# EAGLE design PowerSupply (EAGLE 9.6.2)
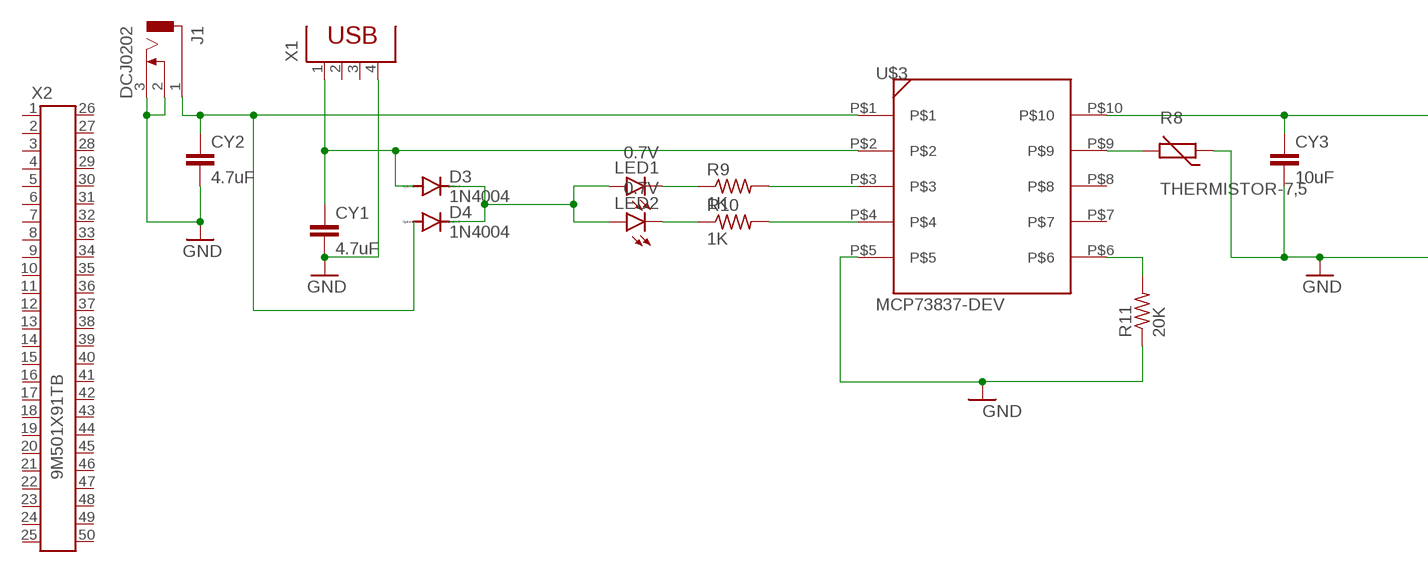
[diagram p0: schematic, sheet 1, part 1 of 2]
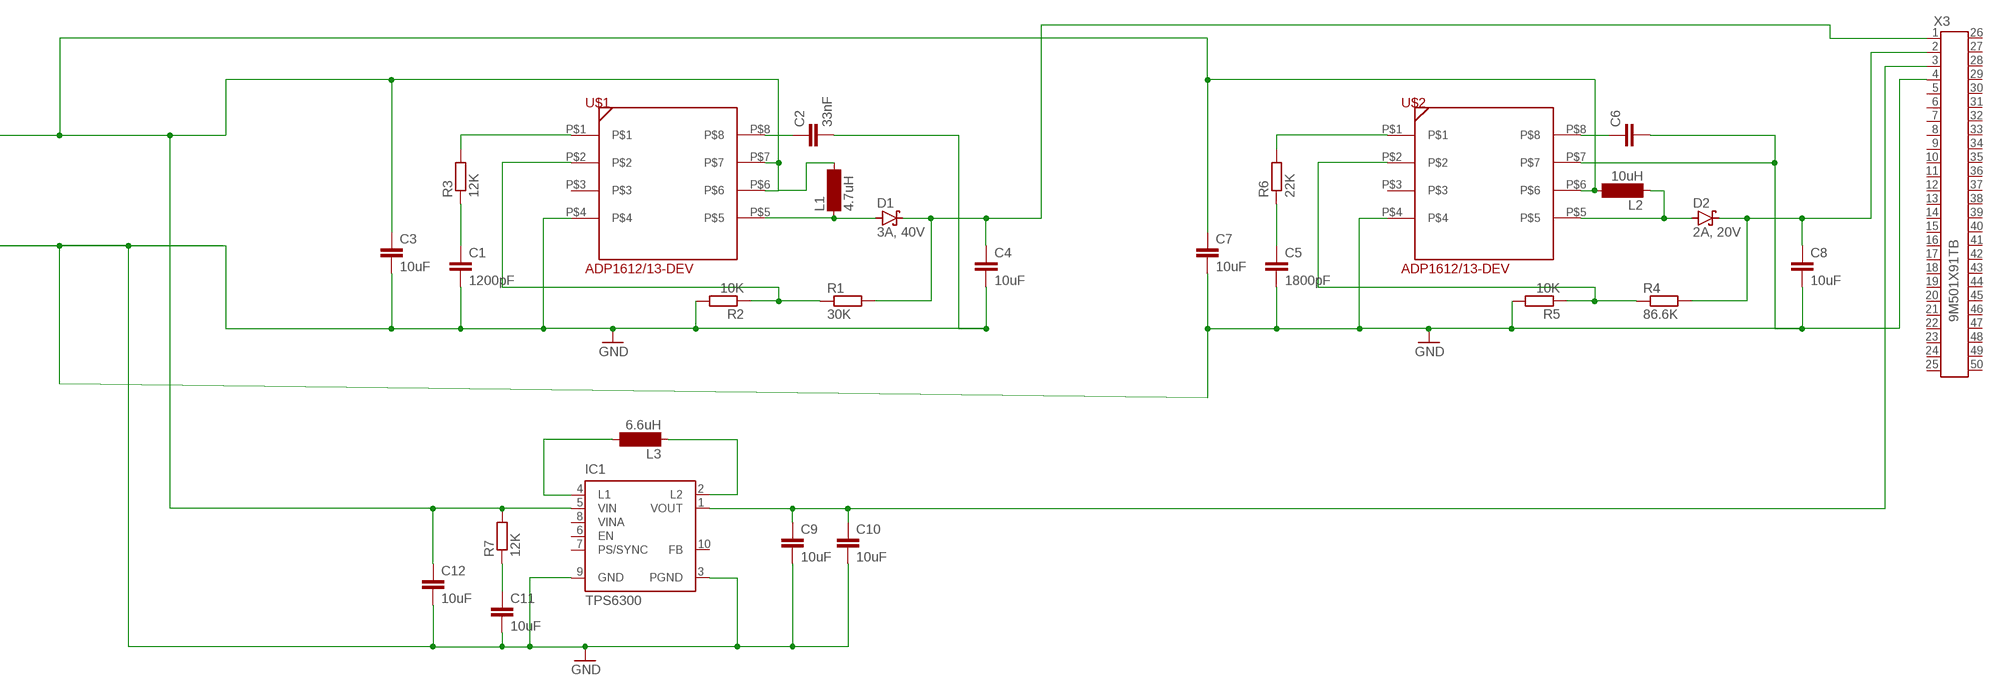
[diagram p1: schematic, sheet 1, part 2 of 2]

## Parts
C1  1200pF  C2.5/2  [C2.5-2]
C2  33nF  C2.5/2  [C2.5-2]
C3  10uF  C2.5/2  [C2.5-2]
C4  10uF  C2.5/2  [C2.5-2]
C5  1800pF  C2.5/2  [C2.5-2]
C6  C2.5/2  [C2.5-2]
C7  10uF  C2.5/2  [C2.5-2]
C8  10uF  C2.5/2  [C2.5-2]
C9  10uF  C2,5-3  [C2.5-3]
C10  10uF  C2,5-3  [C2.5-3]
C11  10uF  C2,5-3  [C2.5-3]
C12  10uF  C2,5-3  [C2.5-3]
CY1  4.7uF  CYYC10B4  [YC10B4]
CY2  4.7uF  CYYC10B4  [YC10B4]
CY3  10uF  CYYC10B4  [YC10B4]
D1  3A, 40V  1N5638  [DO13M]
D2  2A, 20V  1N5638  [DO13M]
D3  1N4004  [DO41-10]
D4  1N4004  [DO41-10]
IC1  TPS6300  [DRC-S-PVSON-N10]
J1  DCJ0202  [DCJ0202]
L1  4.7uH  SM-NE45  [SM-NE45]
L2  10uH  SM-NE45  [SM-NE45]
L3  6.6uH  SM-NE45  [SM-NE45]
LED1  0.7V  LED  [SMARTLED-TTW]
LED2  0.7V  LED  [SMARTLED-TTW]
R1  30K  R-EU_0204/2V  [0204V]
R2  10K  R-EU_0204/2V  [0204V]
R3  12K  R-EU_0204/2V  [0204V]
R4  86.6K  R-EU_0204/2V  [0204V]
R5  10K  R-EU_0204/2V  [0204V]
R6  22K  R-EU_0204/2V  [0204V]
R7  12K  R-EU_0204/2V  [0204V]
R8  THERMISTOR-7,5  [R-7,5]
R9  1K  R-US_0204/2V  [0204V]
R10  1K  R-US_0204/2V  [0204V]
R11  20K  R-US_0204/2V  [0204V]
U$1  ADP1612/13-DEV  [ADP1612/13]
U$2  ADP1612/13-DEV  [ADP1612/13]
U$3  MCP73837-DEV  [MCP73837-FCI]
X1  PN61729  [PN61729]
X2  9M501X91TB  [9M501X91]
X3  9M501X91TB  [9M501X91]

## Nets
GND: C1.2 C2.2 C3.2 C4.2 C5.2 C6.2 C7.2 C8.2 C9.2 C10.2 C11.2 C12.2 CY1.2 CY2.2 CY3.2 IC1.3(PGND) IC1.9(GND) J1.2 J1.3 R2.2 R5.2 R8.1 R11.1 U$1.P$4 U$2.P$4 U$2.P$7 U$3.P$5 X1.4 X3.4
N$1: C2.1 U$1.P$8
N$3: R3.2 U$1.P$1
N$4: C1.1 R3.1
N$5: D1.A L1.1 U$1.P$5
N$6: C4.1 D1.C R1.2 X3.1
N$9: R1.1 R2.1 U$1.P$2
N$10: R6.2 U$2.P$1
N$11: C5.1 R6.1
N$12: C8.1 D2.C R4.2 X3.2
N$13: C6.1 U$2.P$8
N$14: D2.A L2.1 U$2.P$5
N$16: R4.1 R5.1 U$2.P$2
N$18: C11.1 R7.1
N$19: C3.1 C7.1 C12.1 CY3.1 IC1.5(VIN) L1.2 L2.2 R7.2 U$1.P$6 U$1.P$7 U$2.P$6 U$3.P$10
N$20: IC1.4(L1) L3.2
N$21: IC1.2(L2) L3.1
N$22: C9.1 C10.1 IC1.1(VOUT) X3.3
N$23: LED1.C@1(C) R9.1
N$24: LED2.C@1(C) R10.1
N$25: R10.2 U$3.P$4
N$26: R9.2 U$3.P$3
N$27: R11.2 U$3.P$6
N$29: R8.2 U$3.P$9
N$30: CY1.1 D3.A U$3.P$2 X1.1
N$31: D3.C D4.C LED1.A@1(A) LED2.A@1(A)
N$32: CY2.1 D4.A J1.1 U$3.P$1
Unconnected: IC1.6(EN) IC1.7(PS/SYNC) IC1.8(VINA) IC1.10(FB) IC1.TH U$1.P$3 U$2.P$3 U$3.P$7 U$3.P$8 X1.2 X1.3 X2.1 X2.2 X2.3 X2.4 X2.5 X2.6 X2.7 X2.8 X2.9 X2.10 X2.11 X2.12 X2.13 X2.14 X2.15 X2.16 X2.17 X2.18 X2.19 X2.20 X2.21 X2.22 X2.23 X2.24 X2.25 X2.26 X2.27 X2.28 X2.29 X2.30 X2.31 X2.32 X2.33 X2.34 X2.35 X2.36 X2.37 X2.38 X2.39 X2.40 X2.41 X2.42 X2.43 X2.44 X2.45 X2.46 X2.47 X2.48 X2.49 X2.50 X3.5 X3.6 X3.7 X3.8 X3.9 X3.10 X3.11 X3.12 X3.13 X3.14 X3.15 X3.16 X3.17 X3.18 X3.19 X3.20 X3.21 X3.22 X3.23 X3.24 X3.25 X3.26 X3.27 X3.28 X3.29 X3.30 X3.31 X3.32 X3.33 X3.34 X3.35 X3.36 X3.37 X3.38 X3.39 X3.40 X3.41 X3.42 X3.43 X3.44 X3.45 X3.46 X3.47 X3.48 X3.49 X3.50

## Library data of the parts
C1-C12 = capacitor-wima:C: CAPACITOR naming: grid - package width
CY1-CY3 = rcl:CY: Y CAPACITOR for power line; SPICEPREFIX: C
D1 D2 = diode:1N5638: DIODE schottky
D3 D4 = diode:1N4004: DIODE general purpose rectifier, 1 A
IC1 = texas:TPS6300*: HIGH EFFICIENT SINGLE INDUCTOR BUCK-BOOST CONVERTER WITH 1.8-A SWITCHES Source: http://focus.ti.com/lit/ds/symlink/tps63001.pdf; MPN: TPS63000DRCTG4; OC_FARNELL: 1511852; OC_NEWARK: 59M7217
J1 = con-jack:DCJ0202: DC POWER JACK Source: DCJ0202.pdf; OC_FARNELL: unknown; OC_NEWARK: unknown
L1-L3 = inductor-neosid:SM-NE45: INDUCTOR SMD chip inductor; OC_FARNELL: unknown; OC_NEWARK: unknown
LED1 LED2 = led:LED: LED OSRAM: - CHIPLED LG R971, LG N971, LY N971, LG Q971, LY Q971, LO R971, LY R971 LH N974, LH R974 LS Q976, LO Q976, LY Q976 LO Q996 - Hyper CHIPLED LW Q18S LB Q993, LB Q99A, LB R99A - SideLED LS A670, LO A670, LY A670, LG A670, LP A670 LB A673, LV A673, LT A673, LW A673 LH A674 LY A675 LS A676, LA A676, LO A676, LY A676, LW A676 LS A679, LY A679, LG A679 - Hyper Micro SIDELED® LS Y876, LA Y876, LO Y876, LY Y876 LT Y87S - SmartLED LW L88C, LW L88S LB L89C, LB L89S, LG L890 LS L89K, LO L89K, LY L89K LS L896, LA L896, LO L896, LY L896 - TOPLED LS T670, LO T670, LY T670, LG T670, LP T670 LSG T670, LSP T670, LSY T670, LOP T670, LYG T670 LG T671, LOG T671, LSG T671 LB T673, LV T673, LT T673, LW T673 LH T674 LS T676, LA T676, LO T676, LY T676, LB T676, LH T676, LSB T676, LW T676 LB T67C, LV T67C, LT T67C, LS T67K, LO T67K, LY T67K, LW E67C LS E67B, LA E67B, LO E67B, LY E67B, LB E67C, LV E67C, LT E67C LW T67C LS T679, LY T679, LG T679 LS T770, LO T770, LY T770, LG T770, LP T770 LB T773, LV T773, LT T773, LW T773 LH T774 LS E675, LA E675, LY E675, LS T675 LS T776, LA T776, LO T776, LY T776, LB T776 LHGB T686 LT T68C, LB T68C - Hyper Mini TOPLED® LB M676 - Mini TOPLED Santana® LG M470 LS M47K, LO M47K, LY M47K Source: http://www.osram.convergy.de LUXEON: - LUMILED® LXK2-PW12-R00, LXK2-PW12-S00, LXK2-PW14-U00, LXK2-PW14-V00 LXK2-PM12-R00, LXK2-PM12-S00, LXK2-PM14-U00 LXK2-PE12-Q00, LXK2-PE12-R00, LXK2-PE12-S00, LXK2-PE14-T00, LXK2-PE14-U00 LXK2-PB12-K00, LXK2-PB12-L00, LXK2-PB12-M00, LXK2-PB14-N00, LXK2-PB14-P00, LXK2-PB14-Q00 LXK2-PR12-L00, LXK2-PR12-M00, LXK2-PR14-Q00, LXK2-PR14-R00 LXK2-PD12-Q00, LXK2-PD12-R00, LXK2-PD12-S00 LXK2-PH12-R00, LXK2-PH12-S00 LXK2-PL12-P00, LXK2-PL12-Q00, LXK2-PL12-R00 Source: www.luxeon.com KINGBRIGHT: KA-3528ASYC Source: www.kingbright.com
R1-R7 = rcl:R-EU_: RESISTOR, European symbol; SPICEPREFIX: R
R8 = varistor:THERMISTOR: THERMISTOR
R9-R11 = rcl:R-US_: RESISTOR, American symbol; SPICEPREFIX: R
U$1 U$2 = ADP:ADP1612/13-DEV
U$3 = charger:MCP73837-DEV
X1 = con-berg:PN61729: BERG USB connector; OC_FARNELL: unknown; OC_NEWARK: unknown
X2 X3 = con-3m:9M501X91TB: CONNECTOR PCMCIA-CompactFlash; OC_FARNELL: unknown; OC_NEWARK: unknown

## Board
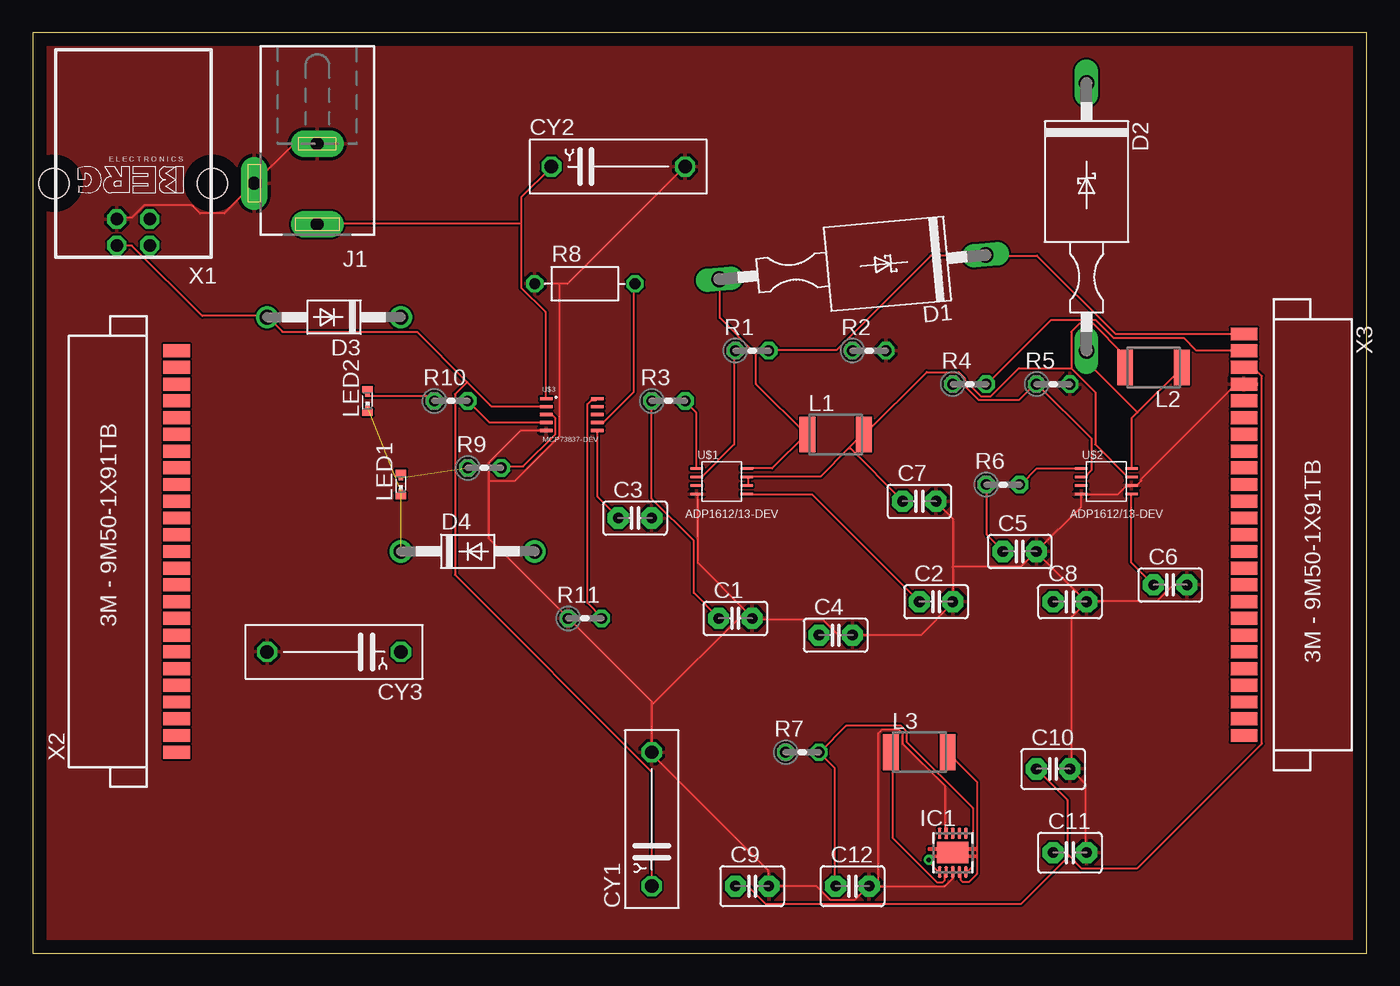
[diagram p2: board, top side]
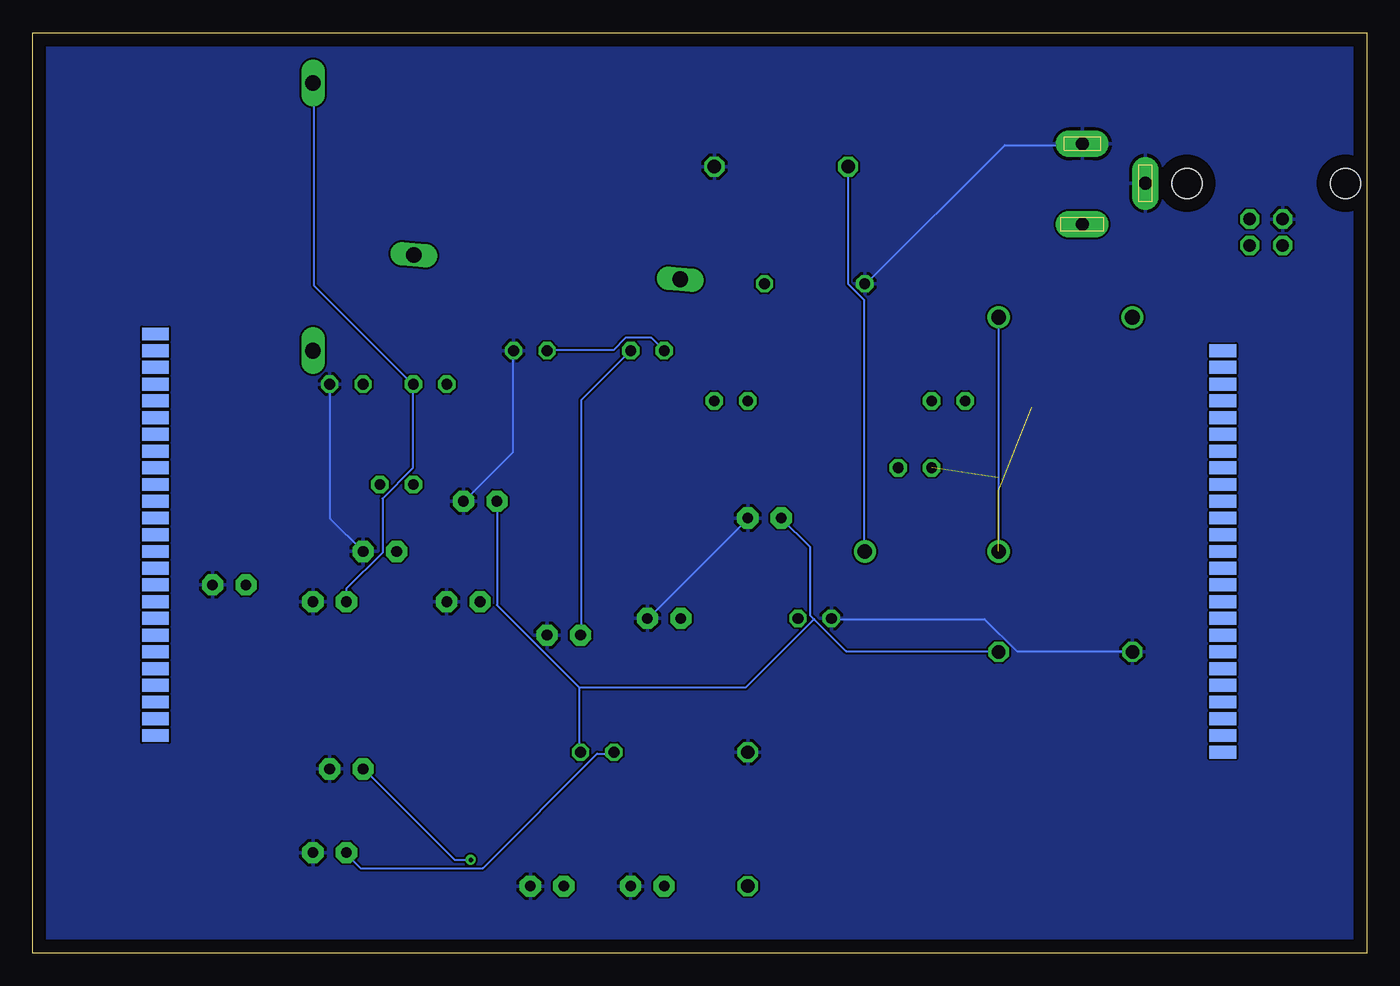
[diagram p3: board, bottom side, seen from below]

Size 101.27 x 69.84 mm. Coordinates in mm from the lower left corner, seen from the top.
Outline: 0,0 101.27,0 101.27,69.84 0,69.84 0,0
Copper layers (1*16): Top 0.035mm / dielectric 1.5mm / Bottom 0.035mm
Design rules "default": minimum track width 6mil, minimum drill 0.35mm, track to track 6mil, track to pad 6mil, pad to pad 6mil, via to via 6mil, smd to smd 6mil, copper to edge 40mil, drill to drill 6mil, minimum pad ring 10mil, minimum via ring 8mil, stop-mask expansion 4mil, vias tented up to drill 0mil, thermal gap 10mil

### Footprints (pad centres in the part's own frame; a part is rotated, then mirrored left to right if it is on the bottom)
C2.5-2 = drill 0.813 pad 1.6 octagon: 1 -1.27,0; 2 1.27,0
C2.5-3 = drill 0.813 pad 1.6 octagon: 1 -1.27,0; 2 1.27,0
YC10B4 = drill 1.016 octagon: 1 -5.08,0; 2 5.08,0
DO13M = drill 1.194 long: A 10.16,0; C -10.16,0
DO41-10 = drill 1.118: A 5.08,0; C -5.08,0
DRC-S-PVSON-N10 = smd 0.28 x 0.85: 1 -1,-1.475; 2 -0.5,-1.475; 3 0,-1.475; 4 0.5,-1.475; 5 1,-1.475; 6 1,1.475; 7 0.5,1.475; 8 0,1.475; 9 -0.5,1.475; 10 -1,1.475 | smd 2.4 x 1.65: TH 0,0
DCJ0202 = drill 1 pad 2 long: 1 0,3.1; 2 4.8,0; 3 0,-3
SM-NE45 = smd 1.2 x 2.7: 1 -2.15,0; 2 2.15,0
SMARTLED-TTW = smd 0.8 x 0.5: A 0,-0.875; C 0,0.875 | smd 0.35 x 0.35: A@1 0,-0.5; C@1 0,0.5
0204V = drill 0.813 octagon: 1 -1.27,0; 2 1.27,0
R-7,5 = drill 0.813 octagon: 1 -3.81,0; 2 3.81,0
ADP1612/13 = smd 0.95 x 0.2: P$1 -0.4,2.5; P$2 -0.4,1.85; P$3 -0.4,1.2; P$4 -0.4,0.55; P$5 3.4,2.5; P$6 3.4,1.85; P$7 3.4,1.2; P$8 3.4,0.55
MCP73837-FCI = smd 0.95 x 0.25: P$1 -0.4,2.7; P$2 -0.4,2.1; P$3 -0.4,1.5; P$4 -0.4,0.9; P$5 -0.4,0.3; P$6 3.5,2.7; P$7 3.5,2.1; P$8 3.5,1.5; P$9 3.5,0.9; P$10 3.5,0.3
PN61729 = drill 0.95 octagon: 1 1.25,4.71; 2 -1.25,4.71; 3 -1.25,2.71; 4 1.25,2.71 | hole 2.3: -6.02,0; 6.02,0
9M501X91 = smd 0.98 x 2.03: 1 -15.24,-3.29; 2 -13.97,-3.29; 3 -12.7,-3.29; 4 -11.43,-3.29; 5 -10.16,-3.29; 6 -8.89,-3.29; 7 -7.62,-3.29; 8 -6.35,-3.29; 9 -5.08,-3.29; 10 -3.81,-3.29; 11 -2.54,-3.29; 12 -1.27,-3.29; 13 0,-3.29; 14 1.27,-3.29; 15 2.54,-3.29; 16 3.81,-3.29; 17 5.08,-3.29; 18 6.35,-3.29; 19 7.62,-3.29; 20 8.89,-3.29; 21 10.16,-3.29; 22 11.43,-3.29; 23 12.7,-3.29; 24 13.97,-3.29; 25 15.24,-3.29 | smd 0.98 x 2.03 bottom: 26 -15.24,-3.29; 27 -13.97,-3.29; 28 -12.7,-3.29; 29 -11.43,-3.29; 30 -10.16,-3.29; 31 -8.89,-3.29; 32 -7.62,-3.29; 33 -6.35,-3.29; 34 -5.08,-3.29; 35 -3.81,-3.29; 36 -2.54,-3.29; 37 -1.27,-3.29; 38 0,-3.29; 39 1.27,-3.29; 40 2.54,-3.29; 41 3.81,-3.29; 42 5.08,-3.29; 43 6.35,-3.29; 44 7.62,-3.29; 45 8.89,-3.29; 46 10.16,-3.29; 47 11.43,-3.29; 48 12.7,-3.29; 49 13.97,-3.29; 50 15.24,-3.29

### Placement (x,y rotation side)
C1  53.34,25.4 0 top
C2  68.58,26.67 0 top
C3  45.72,33.02 0 top
C4  60.96,24.13 0 top
C5  74.93,30.48 0 top
C6  86.36,27.94 0 top
C7  67.31,34.29 0 top
C8  78.74,26.67 0 top
C9  54.61,5.08 0 top
C10  77.47,13.97 0 top
C11  78.74,7.62 0 top
C12  62.23,5.08 0 top
CY1  46.99,10.16 90 top
CY2  44.45,59.69 0 top
CY3  22.86,22.86 180 top
D1  62.23,52.07 185.2 top
D2  80.01,55.88 270 top
D3  22.86,48.26 180 top
D4  33.02,30.48 0 top
IC1  69.85,7.62 0 top
J1  21.59,58.42 180 top
L1  60.96,39.37 0 top
L2  85.09,44.45 180 top
L3  67.31,15.24 0 top
LED1  27.94,35.56 0 top
LED2  25.4,41.91 0 top
R1  54.61,45.72 0 top
R2  63.5,45.72 0 top
R3  48.26,41.91 0 top
R4  71.12,43.18 0 top
R5  77.47,43.18 0 top
R6  73.66,35.56 0 top
R7  58.42,15.24 0 top
R8  41.91,50.8 0 top
R9  34.29,36.83 0 top
R10  31.75,41.91 0 top
R11  41.91,25.4 0 top
U$1  50.8,34.29 0 top
U$2  80.01,34.29 0 top
U$3  39.37,39.37 0 top
X1  7.62,58.42 180 top
X2  7.62,30.48 90 top
X3  95.25,31.75 270 top

### Tracks (layer width: path | path; a pad name or v marks a point on that pad's centre or on a via)
GND
  Top 0.152: 54.15,25.96 54.61,25.5 C1.2 | 54.15,25.96 50.5,29.62 50.5,34.8 U$1.P$4 | C1.2 54.61,25.35 59.94,25.35 61.16,24.13 C4.2 67.41,24.13 69.85,26.57 C2.2 69.85,29.31 | 69.85,29.31 69.85,32.97 68.63,34.19 C7.2 | X3.4 91.34,43.18 84.18,36.02 84.18,35.86 83.87,35.56 83.41,35.56 U$2.P$7 83.26,35.41 82.96,35.41 82.35,34.8 79.76,34.8 U$2.P$4 79.6,34.8 79.6,33.88 C5.2 | C11.2 79.91,7.67 79.91,12.85 78.84,13.92 C10.2 78.84,14.07 78.84,25.5 C8.2 | C8.2 79.91,26.72 76.25,30.38 C5.2 | C6.2 86.61,27.94 85.39,26.72 80.06,26.72 C8.2 | 69.85,29.31 75.03,29.31 C5.2 | IC1.3 69.85,5.69 69.24,5.08 64.21,5.08 | C12.2 64.21,5.08 | 64.21,5.08 64.21,16.66 64.52,16.97 65.73,16.97 66.04,16.66 66.04,15.9 69.24,12.7 69.24,9.2 IC1.9 | 63.6,5.08 C12.2 | C12.2 63.45,5.08 62.38,4.01 60.55,4.01 59.49,5.08 C9.2 55.83,5.08 55.83,6.3 46.99,15.14 CY1.2 46.99,18.8 | 16.82,58.42 14.53,56.13 12.7,56.13 12.09,56.74 8.43,56.74 7.52,55.83 6.45,55.83 X1.4 | 16.82,58.42 19.71,61.32 21.54,61.32 J1.3 | 16.82,58.42 J1.2 | 39.98,50.8 40.59,50.8 49.43,59.64 CY2.2 | 39.98,50.8 R8.1 | 34.65,35.86 34.65,31.44 40.59,25.5 R11.1 40.74,25.35 46.99,19.1 46.99,18.8 | 34.65,35.86 34.65,37.24 37.08,39.67 38.91,39.67 U$3.P$5 | 39.98,50.8 39.98,39.22 36.63,35.86 34.65,35.86 | 46.99,18.8 54.15,25.96 | 54.15,25.96 C1.2
  Bottom 0.152: C3.2 46.99,32.97 54.61,25.35 C1.2 | R2.2 64.82,45.62 64.82,38 68.48,34.34 C7.2 | C5.2 78.69,32.97 78.69,43.18 R5.2 | CY3.2 17.88,22.91 26.57,22.91 29.01,25.35 40.59,25.35 R11.1 | J1.3 21.69,61.32 27.48,61.32 38,50.8 R8.1
  pour Top: -3.81,72.39 101.6,72.39 104.14,69.85 104.14,1.27 99.06,-3.81 1.27,-3.81 -3.81,1.27
  pour Bottom: -5.08,73.66 106.68,73.66 106.68,-5.08 105.41,-5.08 -6.35,-5.08
N$1
  Top 0.152: C2.1 59.18,34.8 54.3,34.8 U$1.P$8
N$3
  Top 0.152: U$1.P$1 50.34,36.78 50.34,41.05 49.58,41.81 R3.2
N$4
  Top 0.152: R3.1 46.99,34.49 50.19,31.29 50.19,27.33 52.02,25.5 C1.1
N$5
  Top 0.152: 58.73,39.37 56.13,36.78 54.3,36.78 U$1.P$5 | 58.73,39.37 54.92,43.18 54.92,45.47 52.17,48.21 52.17,51.11 D1.A | 58.73,39.37 L1.1
N$6
  Top 0.152: X3.1 82.19,46.99 76.25,52.93 72.44,52.93 D1.C 72.29,52.93 68.17,52.93 61.01,45.77 55.98,45.77 R1.2
  Bottom 0.152: R1.2 59.64,41.96 59.64,24.13 C4.1
N$9
  Top 0.152: U$1.P$2 50.5,36.17 50.8,36.17 53.24,38.61 53.24,45.62 R1.1
  Bottom 0.152: R1.1 54.3,46.69 56.29,46.69 57.2,45.77 62.23,45.77 R2.1
N$10
  Top 0.152: U$2.P$1 76.25,36.78 75.03,35.56 R6.2
N$11
  Top 0.152: R6.1 72.44,35.56 72.44,31.75 73.66,30.53 C5.1
N$12
  Top 0.152: X3.2 91.95,45.77 88.29,45.77 87.38,46.69 82.04,46.69 80.67,48.06 77.32,48.06 72.44,43.18 R4.2
  Bottom 0.152: C8.1 77.47,27.64 74.73,30.38 74.73,34.49 72.44,36.78 72.44,43.18 | 72.44,43.18 79.91,50.65 79.91,66.04 D2.C | 72.44,43.18 R4.2
N$13
  Top 0.152: C6.1 83.41,29.62 83.41,34.8 U$2.P$8
N$14
  Top 0.152: 83.87,41.05 87.22,44.4 L2.1 | 83.87,41.05 83.41,40.59 U$2.P$5 | 83.87,41.05 80.06,44.86 80.06,45.62 D2.A
N$16
  Top 0.152: U$2.P$2 79.76,36.17 79.91,36.17 80.37,36.63 80.37,39.06 76.25,43.18 R5.1 76.1,43.18 74.88,41.96 71.83,41.96 70.61,43.18 R4.1
N$18
  Bottom 0.152: R7.1 57.2,15.14 58.42,15.14 67.11,6.45 76.4,6.45 77.47,7.52 C11.1
N$19
  Top 0.152: U$3.P$10 42.88,34.65 44.4,33.12 C3.1 | IC1.5 70.92,6.15 71.37,6.6 71.37,11.02 66.34,16.05 66.34,16.82 65.89,17.27 61.77,17.27 59.79,15.29 R7.2 60.86,14.07 60.86,5.08 C12.1 | 78.84,44.4 80.67,42.57 80.67,38.61 83.11,36.17 83.26,36.17 U$2.P$6 | 78.84,44.4 78.84,47.14 79.45,47.75 80.52,47.75 82.8,45.47 82.8,44.55 L2.2 | 54.3,36.17 54.3,35.56 U$1.P$7 | 54.3,36.17 59.79,36.17 61.93,38.3 | 61.93,38.3 62.99,39.37 L1.2 63.14,39.37 67.87,44.09 70.31,44.09 70.76,43.64 70.76,43.48 71.98,42.27 72.75,42.27 74.88,44.4 78.84,44.4 | 54.3,36.17 U$1.P$6 | 61.93,38.3 62.08,38.3 66.04,34.34 C7.1
  Bottom 0.152: 41.96,25.35 42.27,25.65 42.27,30.84 C3.1 | 41.96,25.35 39.52,22.91 27.94,22.91 CY3.1 | 59.79,20.17 59.79,15.29 R7.2 | 59.79,20.17 66.04,26.42 C7.1 | 41.96,25.35 47.14,20.17 59.79,20.17
N$20
  Top 0.152: IC1.4 70.46,5.99 70.46,5.54 70.61,5.38 71.07,5.38 71.68,5.99 71.68,13 69.55,15.14 L3.2
N$21
  Top 0.152: IC1.2 69.24,5.99 69.24,5.54 69.09,5.38 68.63,5.38 65.28,8.74 65.28,15.14 L3.1
N$22  (via drill 0.35)
  Top 0.152: v68.02,7.06 68.02,6.91 68.78,6.15 IC1.1 | 78.69,7.37 78.54,7.52 78.54,11.63 C10.1 | 78.69,7.37 79.6,6.45 83.87,6.45 93.32,15.9 93.32,43.79 92.71,44.4 92.1,44.4 X3.3 | C9.1 54.3,5.08 55.68,3.71 75.03,3.71 78.69,7.37
  Bottom 0.152: v68.02,7.06 69.24,7.06 76.1,13.92 C10.1
N$23  (1 unrouted)
N$24
  Top 0.152: LED2.C@1 25.5,42.27 30.07,42.27 30.38,41.96 R10.1
N$25
  Top 0.152: R10.2 34.65,40.28 38.91,40.28 U$3.P$4
N$26
  Top 0.152: U$3.P$3 39.07,40.89 39.37,40.89 39.68,40.59 39.68,39.37 37.24,36.93 35.56,36.93 R9.2
N$27
  Top 0.152: U$3.P$6 42.72,41.96 42.42,41.96 42.11,41.66 42.11,26.57 43.18,25.5 R11.2
N$29
  Top 0.152: U$3.P$9 42.88,40.28 43.33,40.28 45.62,42.57 45.62,50.8 R8.2
N$30
  Top 0.152: 32.97,43.33 29.16,47.14 18.95,47.14 17.88,48.21 D3.A 17.73,48.36 12.85,48.36 7.52,53.7 6.45,53.7 X1.1 | 32.97,43.33 34.8,41.5 38.91,41.5 U$3.P$2 | CY1.1 46.99,13.77 32.05,28.7 32.05,42.42 32.97,43.33
N$31  (2 unrouted)
  Bottom 0.152: D3.C D4.C
N$32
  Top 0.152: 37.08,55.37 37.08,57.35 39.37,59.64 CY2.1 | 37.08,55.37 37.08,50.5 38.91,48.67 38.91,42.11 U$3.P$1 | 37.08,55.37 21.69,55.37 J1.1
  Bottom 0.152: CY2.1 39.37,50.8 38.15,49.58 38.15,30.53 D4.A